# EAGLE design DS3231_Shield (EAGLE 6.5.0)
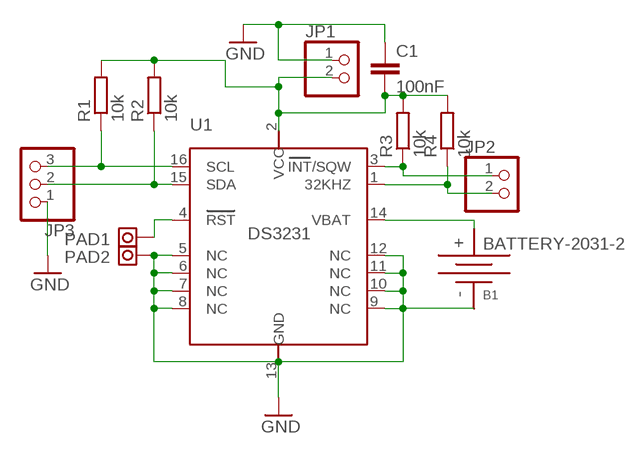
[diagram p0: schematic, sheet 1]

## Parts
B1  BATTERY-2031-2  [BTH2032-2]
C1  100nF  C-EUC0805  [C0805]
JP1  PINHD-1X2  [1X02]
JP2  PINHD-1X2  [1X02]
JP3  PINHD-1X3  [1X03]
PAD1  PAD  [PAD]
PAD2  PAD  [PAD]
R1  10k  R-EU_R0805  [R0805]
R2  10k  R-EU_R0805  [R0805]
R3  10k  R-EU_R0805  [R0805]
R4  10k  R-EU_R0805  [R0805]
U1  DS3231  [SO16L]

## Nets
GND: B1.- C1.1 JP1.1 JP3.1 PAD2.P$1(PAD) U1.5(NC) U1.6(NC) U1.7(NC) U1.8(NC) U1.9(NC) U1.10(NC) U1.11(NC) U1.12(NC) U1.13(GND)
N$1: C1.2 JP1.2 R1.2 R2.2 R3.2 R4.2 U1.2(VCC)
N$2: B1.+ U1.14(VBAT)
N$3: PAD1.P$1(PAD) U1.4(RST)
N$4: JP3.2 R2.1 U1.15(SDA)
N$5: JP3.3 R1.1 U1.16(SCL)
N$7: JP2.1 R3.1 U1.3(INT/SQW)
N$8: JP2.2 R4.1 U1.1(32KHZ)

## Library data of the parts
B1 = usb:BATTERY
C1 = rcl:C-EU: CAPACITOR, European symbol
JP1 JP2 = pinhead:PINHD-1X2: PIN HEADER
JP3 = pinhead:PINHD-1X3: PIN HEADER
PAD1 PAD2 = usb:PAD
R1-R4 = rcl:R-EU_: RESISTOR, European symbol
U1 = usb:DS3231: Real-Time Clock DS3231

## Board
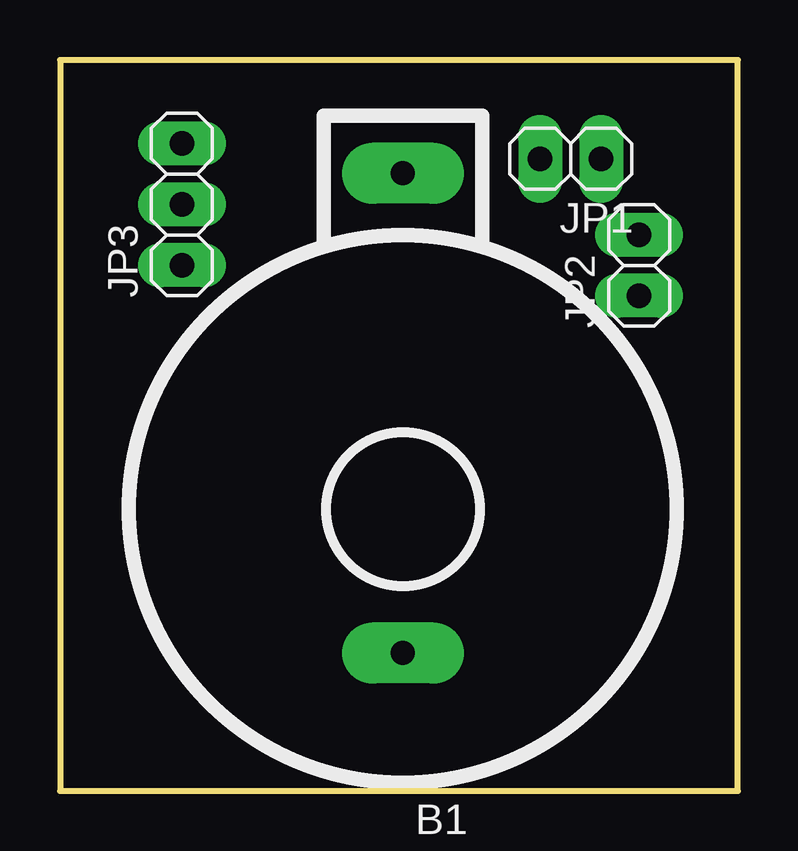
[diagram p1: board, top side]
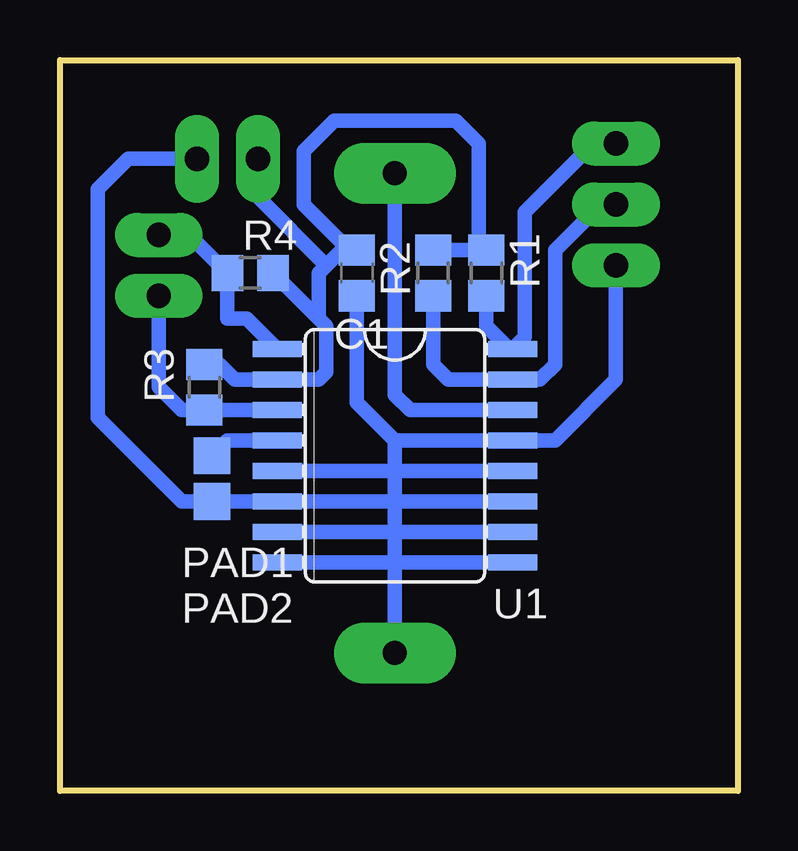
[diagram p2: board, bottom side, seen from below]

Size 28.25 x 30.47 mm. Coordinates in mm from the lower left corner, seen from the top.
Outline: 0,0 28.25,0 28.25,30.47 0,30.47 0,0
Copper layers (1*16): Top 0.035mm / dielectric 1.5mm / Bottom 0.035mm
Design rules "default": minimum track width 12mil, minimum drill 32mil, track to track 12mil, track to pad 12mil, pad to pad 12mil, via to via 12mil, smd to smd 8mil, copper to edge 40mil, drill to drill 8mil, minimum pad ring 16mil, minimum via ring 12mil, stop-mask expansion 4mil, vias tented up to drill 0mil, thermal gap 20mil

### Footprints (pad centres in the part's own frame; a part is rotated, then mirrored left to right if it is on the bottom)
BTH2032-2 = drill 1 pad 2.54 long: + 0,-14; - 0,6
C0805 = smd 1.3 x 1.5: 1 -0.95,0; 2 0.95,0
1X02 = drill 1.016 long: 1 -1.27,0; 2 1.27,0
1X03 = drill 1.016 long: 1 -2.54,0; 2 0,0; 3 2.54,0
PAD = smd 1.524 x 1.524: P$1 0,0
R0805 = smd 1.3 x 1.5: 1 -0.95,0; 2 0.95,0
SO16L = smd 0.66 x 2.032: 1 -4.445,-4.902; 2 -3.175,-4.902; 3 -1.905,-4.902; 4 -0.635,-4.902; 5 0.635,-4.902; 6 1.905,-4.902; 7 3.175,-4.902; 8 4.445,-4.902; 9 4.445,4.902; 10 3.175,4.902; 11 1.905,4.902; 12 0.635,4.902; 13 -0.635,4.902; 14 -1.905,4.902; 15 -3.175,4.902; 16 -4.445,4.902

### Placement (x,y rotation side)
B1  14.29,11.75 180 top
C1  15.88,21.59 90 bottom
JP1  21.27,26.35 180 top
JP2  24.13,21.91 90 top
JP3  5.08,24.45 90 top
PAD1  21.91,13.97 0 bottom
PAD2  21.91,12.06 0 bottom
R1  10.48,21.59 90 bottom
R2  12.7,21.59 90 bottom
R3  22.23,16.83 90 bottom
R4  20.32,21.59 0 bottom
U1  14.29,13.97 270 bottom

### Tracks (layer width: path | path; a pad name or v marks a point on that pad's centre or on a via)
GND
  Bottom 0.61: U1.9 14.29,9.53 | 14.29,9.53 U1.8 | U1.10 14.29,10.79 | U1.7 14.29,10.79 | 14.29,10.79 14.29,9.53 | U1.11 14.29,12.06 | 14.29,12.06 14.29,10.79 | 14.29,12.06 U1.6 PAD2.P$1 23.18,12.06 26.67,15.56 26.67,25.08 25.4,26.35 JP1.1 | U1.5 14.29,13.34 | 14.29,13.34 14.29,12.06 | U1.12 14.29,13.34 | 14.29,14.61 U1.13 7.62,14.61 5.08,17.14 JP3.1 | 14.29,14.61 14.29,13.34 | B1.- 14.29,9.53 | C1.1 15.88,16.19 14.29,14.61
N$1
  Bottom 0.61: R3.2 21.59,17.78 20.95,17.14 U1.2 17.46,17.14 17.14,17.46 17.14,19.37 17.46,19.68 | R4.2 17.46,19.68 | 17.14,21.91 16.51,22.54 C1.2 16.19,22.54 18.1,24.45 18.1,26.67 16.83,27.94 11.75,27.94 10.79,26.99 10.79,22.86 R1.2 R2.2 | 17.14,21.91 17.46,21.59 17.46,19.68 | JP1.2 20,24.77 17.14,21.91
N$2
  Bottom 0.61: B1.+ 14.29,16.51 13.65,15.88 U1.14
N$3
  Bottom 0.61: U1.4 21.27,14.61 PAD1.P$1
N$4
  Bottom 0.61: R2.1 12.7,17.78 12.06,17.14 U1.15 8.26,17.14 7.62,17.78 7.62,22.54 5.71,24.45 JP3.2
N$5
  Bottom 0.61: R1.1 10.48,19.37 9.53,18.41 U1.16 8.89,18.91 8.89,24.13 6.03,26.99 JP3.3
N$7
  Bottom 0.61: U1.3 R3.1 23.18,15.88 24.13,16.83 JP2.1
N$8
  Bottom 0.61: U1.1 20.46,19.68 21.27,19.68 21.27,19.69 R4.1 22.86,23.18 JP2.2

### Text on the board
S: VCC | GND | SCL | SDA | 32k | GND | SQW